# Altium project Rover Power Board V2.PrjPcb
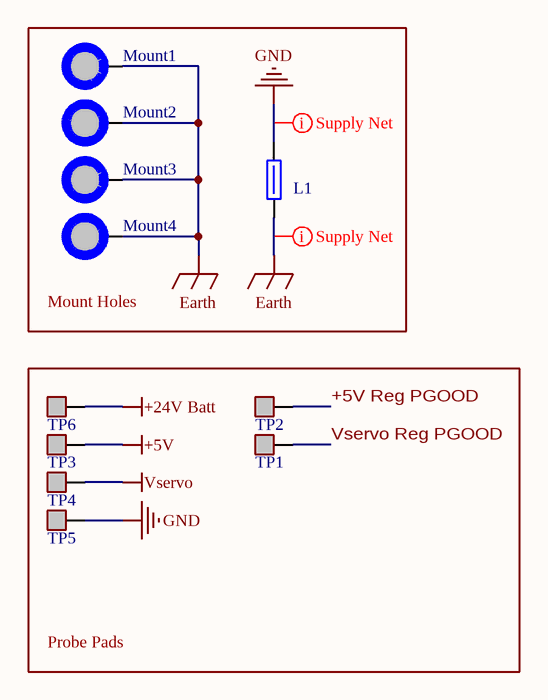
[diagram p0: Overview.SchDoc]
2 sheets, 18 parts. Net scope: global (net labels, ports and power ports of the same name join across sheets).
Board file: Main.PcbDoc
Sheets:
  Overview.SchDoc
  Power Outputs.SchDoc

## Sheet Overview.SchDoc
size A; SheetNumber: 1; SheetTotal: 4

### Parts
L1  652-MH2029-300Y  [[Ferrite] SMD Bead 0805 (1)]  (value not drawn)
Mount1  M3 Mount Hole  [[Mount] M3 Mount Hole]  (value not drawn)  (no BOM)
Mount2  M3 Mount Hole  [[Mount] M3 Mount Hole]  (value not drawn)  (no BOM)
Mount3  M3 Mount Hole  [[Mount] M3 Mount Hole]  (value not drawn)  (no BOM)
Mount4  M3 Mount Hole  [[Mount] M3 Mount Hole]  (value not drawn)  (no BOM)
TP1  Probe Pad  [[Probe] Touch Pad]  (value not drawn)  (no BOM)
TP2  Probe Pad  [[Probe] Touch Pad]  (value not drawn)  (no BOM)
TP3  Probe Pad  [[Probe] Touch Pad]  (value not drawn)  (no BOM)
TP4  Probe Pad  [[Probe] Touch Pad]  (value not drawn)  (no BOM)
TP5  Probe Pad  [[Probe] Touch Pad]  (value not drawn)  (no BOM)
TP6  Probe Pad  [[Probe] Touch Pad]  (value not drawn)  (no BOM)

### Blocks framed on the sheet
Mount Holes: L1 Mount1-Mount4
Probe Pads: TP1-TP6

### Nets
+5V: TP3.1
+24V Batt: TP6.1
Earth: L1.1 Mount1.1 Mount2.1 Mount3.1 Mount4.1
GND: L1.2 TP5.1
Vservo: TP4.1
+5V Reg PGOOD: TP2.1
Vservo Reg PGOOD: TP1.1

### Layout directives
net class Supply_Nets: Earth, GND

### Library data of the parts
L1 = [Ferrite] SMD Ferrite Bead (1): Res @ Freq: 30 @ 100MHz; Size Package: 0805; Supplier 1: DigiKey; Supplier Part Number 1: MH2029-300YCT-ND
Mount1-Mount4 = [Mount] M3 Mount Hole: Place at least 4.5mm from board edge. Plated.
TP1-TP6 = [Probe] Touch Pad

## Sheet Power Outputs.SchDoc
size A; SheetNumber: 4; SheetTotal: 4
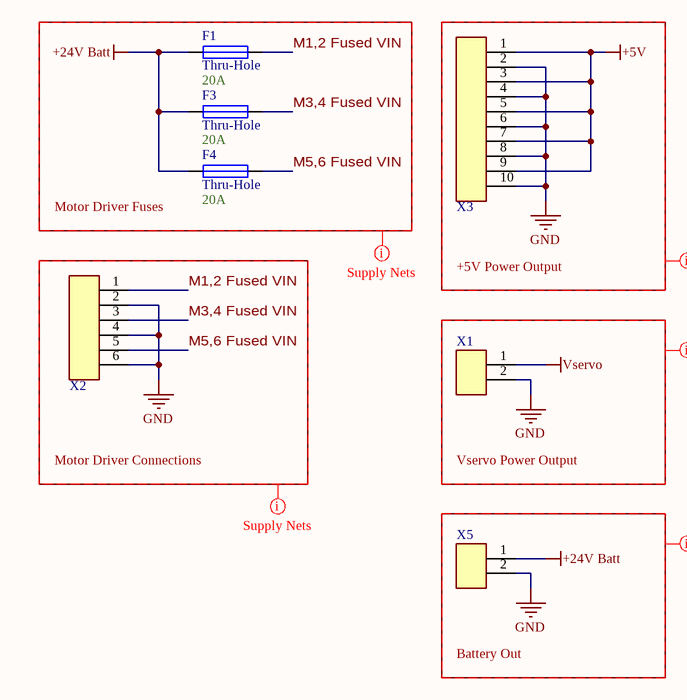
[diagram p1: Power Outputs.SchDoc]

### Parts
F1  Thru-Hole  Capacity: 20A  [[Fuse] Thru-Hole Blade]
F3  Thru-Hole  Capacity: 20A  [[Fuse] Thru-Hole Blade]
F4  Thru-Hole  Capacity: 20A  [[Fuse] Thru-Hole Blade]
X1  2pin Screw Terminal  [[Screw Terminal] 2pin 5mm]  (value not drawn)
X2  [Screw Terminal] 6pin  [[Screw Terminal] 6pin]  (value not drawn)
X3  [Screw Terminal] 10pin  [[Screw Terminal] 10pin]  (value not drawn)
X5  2pin Screw Terminal  [[Screw Terminal] 2pin 5mm]  (value not drawn)

### Blocks framed on the sheet
Motor Driver Fuses: F1 F3 F4
+5V Power Output: X3
Motor Driver Connections: X2
Vservo Power Output: X1
Battery Out: X5

### Nets
+5V: X3.1 X3.3 X3.5 X3.7 X3.9
+24V Batt: F1.1 F3.1 F4.1 X5.1
GND: X1.2 X2.2 X2.4 X2.6 X3.2 X3.4 X3.6 X3.8 X3.10 X5.2
Vservo: X1.1
M1,2 Fused VIN: F1.2 X2.1
M3,4 Fused VIN: F3.2 X2.3
M5,6 Fused VIN: F4.2 X2.5

### Layout directives
net class Supply_Nets: +5V, +24V Batt, GND, M1,2 Fused VIN, M3,4 Fused VIN, M5,6 Fused VIN, Vservo

### Library data of the parts
F1 F3 F4 = [Fuse] Thru-Hole Blade: Mouser Part #: *; Supplier 1: DigiKey; Supplier Part Number 1: WK6265-ND
X1 X5 = [Screw Terminal] 2pin: Supplier 1: DigiKey; Supplier Part Number 1: 102-6145-ND
X2 = [Screw Terminal] 6pin: x3; Supplier 1: DigiKey; Supplier Part Number 1: 102-6145-ND
X3 = [Screw Terminal] 10pin: x5; Supplier 1: DigiKey; Supplier Part Number 1: 102-6145-ND

## Nets that join several sheets
+5V: Overview (TP3.1), Power Outputs (5 pins)
+24V Batt: Overview (TP6.1), Power Outputs (F1.1 F3.1 F4.1 X5.1)
GND: Overview (L1.2 TP5.1), Power Outputs (10 pins)
Vservo: Overview (TP4.1), Power Outputs (X1.1)